# EAGLE design mimic1579 (EAGLE 7.5.0)
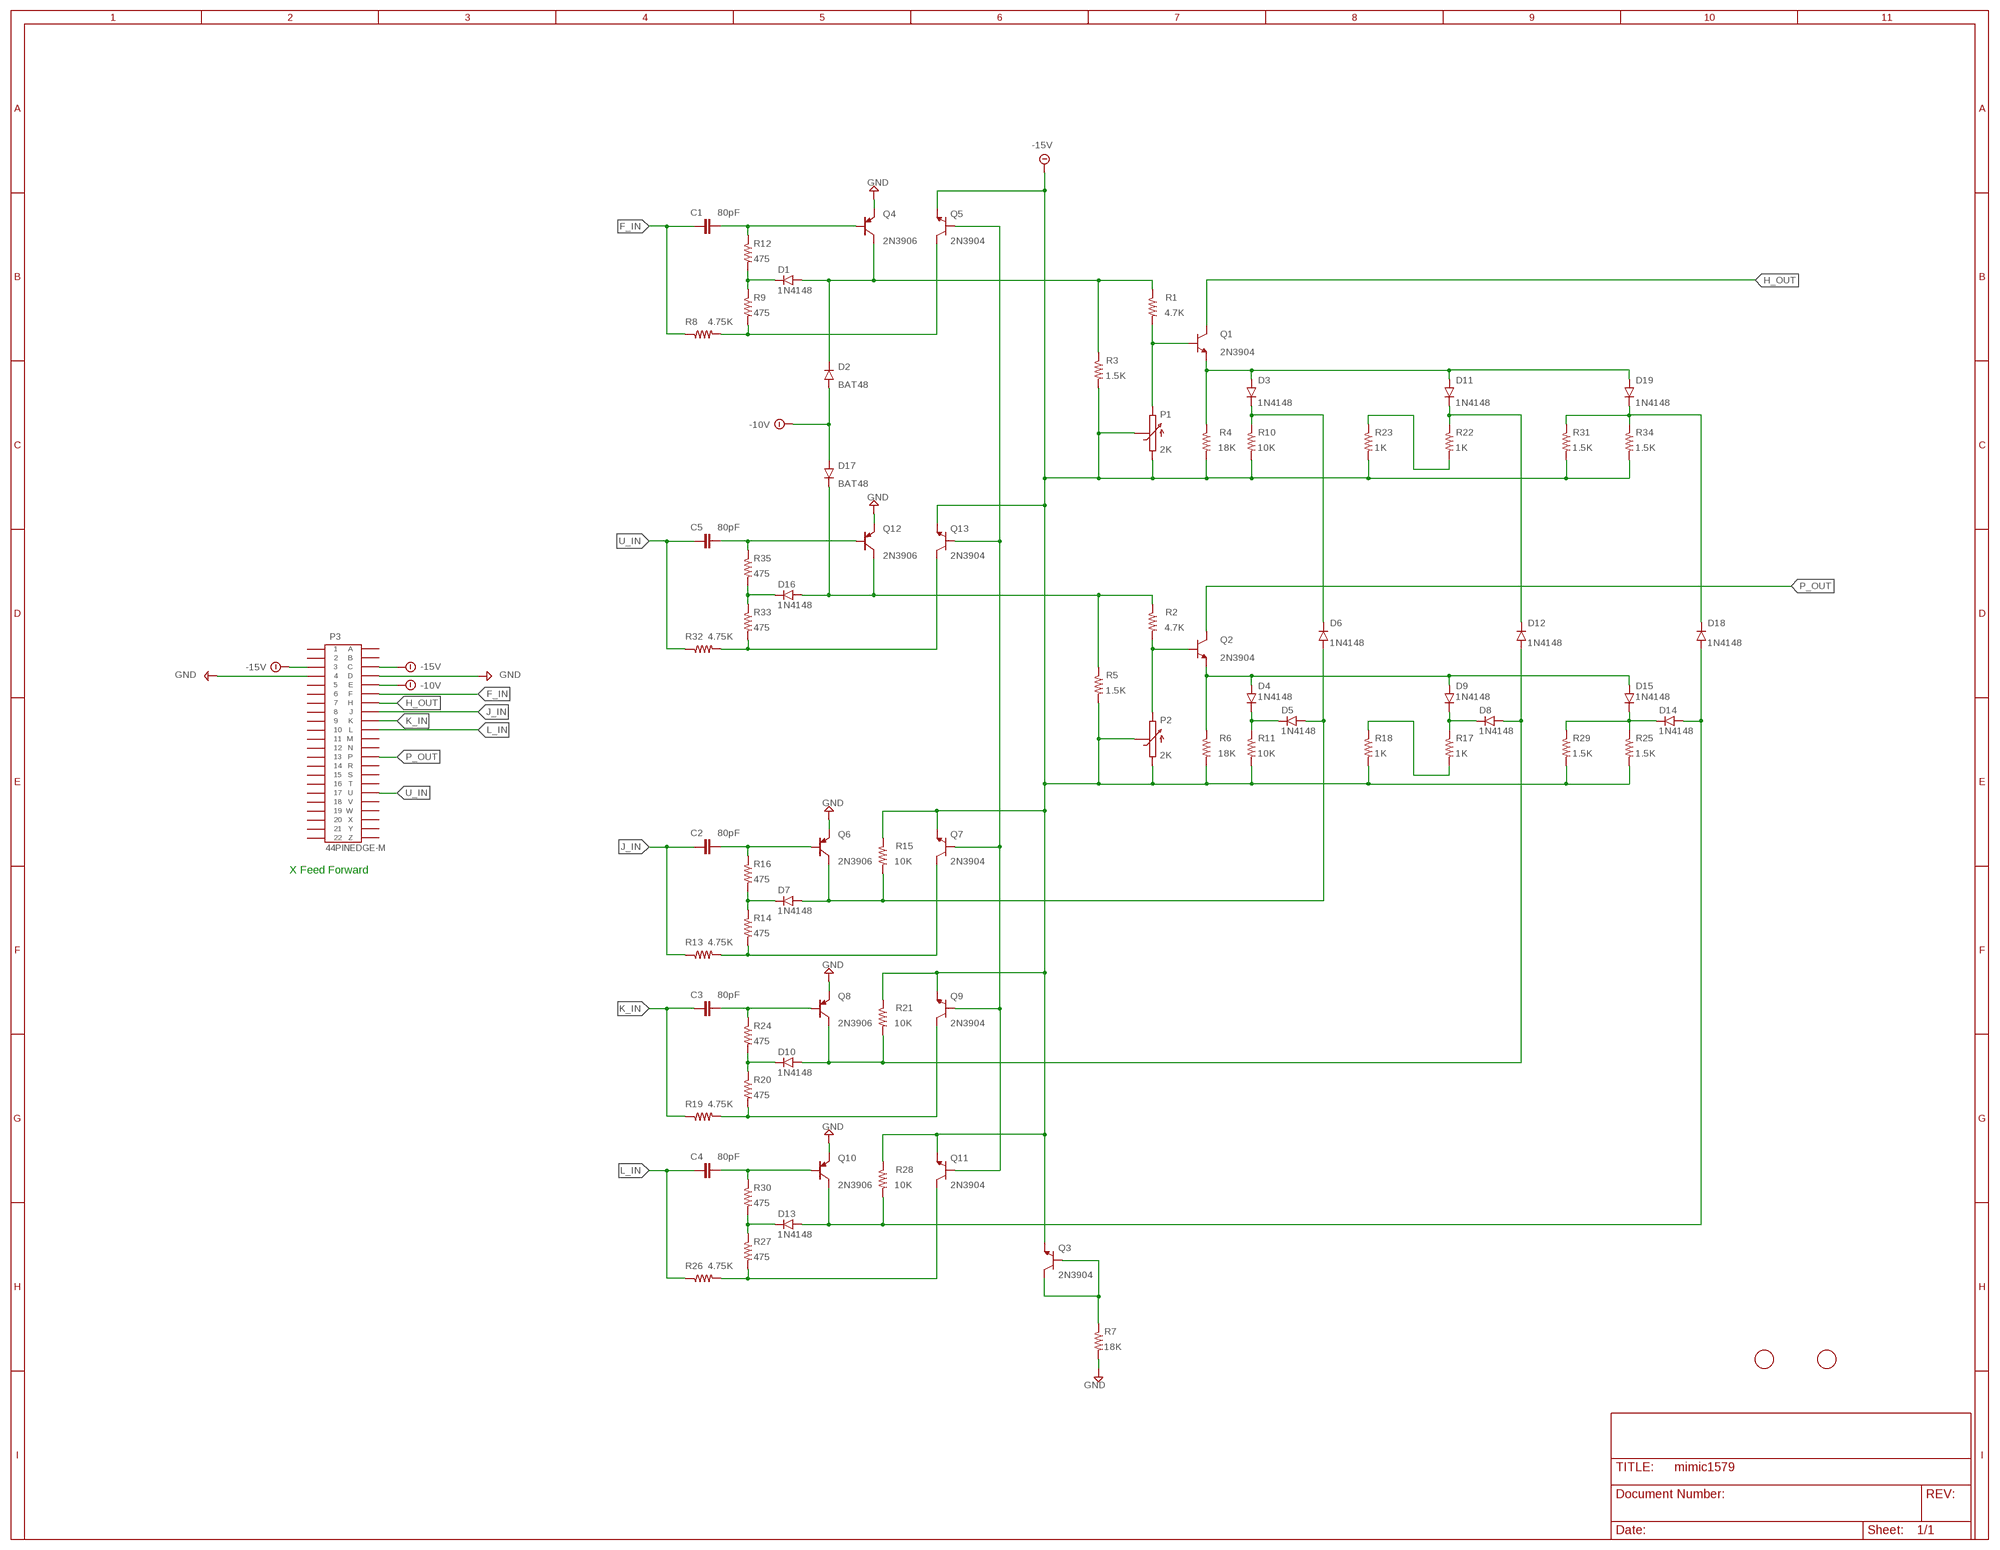
[diagram p0: schematic, sheet 1]

## Parts
C1  80pF  CAP80PF  [5MM_TH]
C2  80pF  CAP80PF  [5MM_TH]
C3  80pF  CAP80PF  [5MM_TH]
C4  80pF  CAP80PF  [5MM_TH]
C5  80pF  CAP80PF  [5MM_TH]
D1  1N4148  [DO35-7]
D2  BAT48  1N4148  [DO35-7]
D3  1N4148  [DO35-7]
D4  1N4148  [DO35-7]
D5  1N4148  [DO35-7]
D6  1N4148  [DO35-7]
D7  1N4148  [DO35-7]
D8  1N4148  [DO35-7]
D9  1N4148  [DO35-7]
D10  1N4148  [DO35-7]
D11  1N4148  [DO35-7]
D12  1N4148  [DO35-7]
D13  1N4148  [DO35-7]
D14  1N4148  [DO35-7]
D15  1N4148  [DO35-7]
D16  1N4148  [DO35-7]
D17  BAT48  1N4148  [DO35-7]
D18  1N4148  [DO35-7]
D19  1N4148  [DO35-7]
P1  2K  POT-3006P  [3006P]
P2  2K  POT-3006P  [3006P]
P3  44PINEDGE-M  [44PINEDGE]
Q1  2N3904  [TO92]
Q2  2N3904  [TO92]
Q3  2N3904  [TO92]
Q4  2N3906  [TO92]
Q5  2N3904  [TO92]
Q6  2N3906  [TO92]
Q7  2N3904  [TO92]
Q8  2N3906  [TO92]
Q9  2N3904  [TO92]
Q10  2N3906  [TO92]
Q11  2N3904  [TO92]
Q12  2N3906  [TO92]
Q13  2N3904  [TO92]
R1  4.7K  R-1/4WATT  [0207/10]
R2  4.7K  R-1/4WATT  [0207/10]
R3  1.5K  R-1/4WATT  [0207/10]
R4  18K  R-1/4WATT  [0207/10]
R5  1.5K  R-1/4WATT  [0207/10]
R6  18K  R-1/4WATT  [0207/10]
R7  18K  R-1/4WATT  [0207/10]
R8  4.75K  R-1/4WATT  [0207/10]
R9  475  R-1/4WATT  [0207/10]
R10  10K  R-1/4WATT  [0207/10]
R11  10K  R-1/4WATT  [0207/10]
R12  475  R-1/4WATT  [0207/10]
R13  4.75K  R-1/4WATT  [0207/10]
R14  475  R-1/4WATT  [0207/10]
R15  10K  R-1/4WATT  [0207/10]
R16  475  R-1/4WATT  [0207/10]
R17  1K  R-1/4WATT  [0207/10]
R18  1K  R-1/4WATT  [0207/10]
R19  4.75K  R-1/4WATT  [0207/10]
R20  475  R-1/4WATT  [0207/10]
R21  10K  R-1/4WATT  [0207/10]
R22  1K  R-1/4WATT  [0207/10]
R23  1K  R-1/4WATT  [0207/10]
R24  475  R-1/4WATT  [0207/10]
R25  1.5K  R-1/4WATT  [0207/10]
R26  4.75K  R-1/4WATT  [0207/10]
R27  475  R-1/4WATT  [0207/10]
R28  10K  R-1/4WATT  [0207/10]
R29  1.5K  R-1/4WATT  [0207/10]
R30  475  R-1/4WATT  [0207/10]
R31  1.5K  R-1/4WATT  [0207/10]
R32  4.75K  R-1/4WATT  [0207/10]
R33  475  R-1/4WATT  [0207/10]
R34  1.5K  R-1/4WATT  [0207/10]
R35  475  R-1/4WATT  [0207/10]
U$1  FIDUCIAL  [FIDUCIAL_1MM]
U$2  FIDUCIAL  [FIDUCIAL_1MM]

## Nets
-10V: D2.A D17.A P3.E
-15V: P1.1 P1.2 P2.1 P2.2 P3.3 P3.C Q3.1(E) Q5.1(E) Q7.1(E) Q9.1(E) Q11.1(E) Q13.1(E) R3.2 R4.2 R5.2 R6.2 R10.2 R11.2 R15.1 R18.2 R21.1 R23.2 R25.2 R28.1 R29.2 R31.2 R34.2
F_IN: C1.1 P3.F R8.1
GND: P3.4 P3.D Q4.3(E) Q6.3(E) Q8.3(E) Q10.3(E) Q12.3(E) R7.2
H_OUT: P3.H Q1.3(C)
J_IN: C2.1 P3.J R13.1
K_IN: C3.1 P3.K R19.1
L_IN: C4.1 P3.L R26.1
N$1: C1.2 Q4.2(B) R12.1
N$2: Q5.3(C) R8.2 R9.2
N$3: C3.2 Q8.2(B) R24.1
N$4: P1.3 Q1.2(B) R1.2
N$5: D3.A D11.A D19.A Q1.1(E) R4.1
N$6: D3.C D6.C R10.1
N$7: R22.2 R23.1
N$8: Q9.3(C) R19.2 R20.2
N$9: D1.C R9.1 R12.2
N$10: D11.C D12.C R22.1
N$11: D18.C D19.C R31.1 R34.1
N$12: D10.C R20.1 R24.2
N$13: C4.2 Q10.2(B) R30.1
N$14: C5.2 Q12.2(B) R35.1
N$15: Q13.3(C) R32.2 R33.2
N$16: P2.3 Q2.2(B) R2.2
N$17: D4.A D9.A D15.A Q2.1(E) R6.1
N$18: D4.C D5.C R11.1
N$19: D8.C D9.C R17.1
N$20: R17.2 R18.1
N$21: D14.C D15.C R25.1 R29.1
N$22: Q11.3(C) R26.2 R27.2
N$23: D13.C R27.1 R30.2
N$24: Q3.2(B) Q3.3(C) R7.1
N$25: D16.C R33.1 R35.2
N$30: C2.2 Q6.2(B) R16.1
N$31: Q7.3(C) R13.2 R14.2
N$32: D7.C R14.1 R16.2
N$33: Q5.2(B) Q7.2(B) Q9.2(B) Q11.2(B) Q13.2(B)
P_OUT: P3.P Q2.3(C)
U_IN: C5.1 P3.U R32.1
VREF: D1.A D2.C Q4.1(C) R1.1 R3.1
VREF1: D8.A D10.A D12.A Q8.1(C) R21.2
VREF2: D13.A D14.A D18.A Q10.1(C) R28.2
VREF3: D5.A D6.A D7.A Q6.1(C) R15.2
VREF5: D16.A D17.C Q12.1(C) R2.1 R5.1
Unconnected: P3.1 P3.2 P3.5 P3.6 P3.7 P3.8 P3.9 P3.10 P3.11 P3.12 P3.13 P3.14 P3.15 P3.16 P3.17 P3.18 P3.19 P3.20 P3.21 P3.22 P3.A P3.B P3.M P3.N P3.R P3.S P3.T P3.V P3.W P3.X P3.Y P3.Z

## Notes on the sheet
- X Feed Forward

## Library data of the parts
C1-C5 = keiths:CAP80PF: 0 Leaded 100V 80pF X7R 10% RAD LS:5mm
D1 D3-D16 D18 D19 = replacements:1N4148: High Conductance Fast Diode
D2 D17 = replacements:1N4148: High Conductance Fast Diode; PN: BAT48RL
P1 P2 = keiths:POT-3006P: 3006 - Trimpot® Trimming Potentiometer. Clockwise turn moves wiper to pin 3
P3 = keiths:44PINEDGE-M: 44 PIN EDGE CONNECTOR FOR PCB
Q1-Q3 Q5 Q7 Q9 Q11 Q13 = keiths:2N3904: NPN Transistor
Q4 Q6 Q8 Q10 Q12 = keiths:2N3906: PNP Transistor
R1-R35 = replacements:R-1/4WATT: Quarter watt through hole resistor.
U$1 U$2 = adafruit:FIDUCIAL: For use by pick and place machines to calibrate the vision/machine, 1mm By microbuilder.eu

## Board
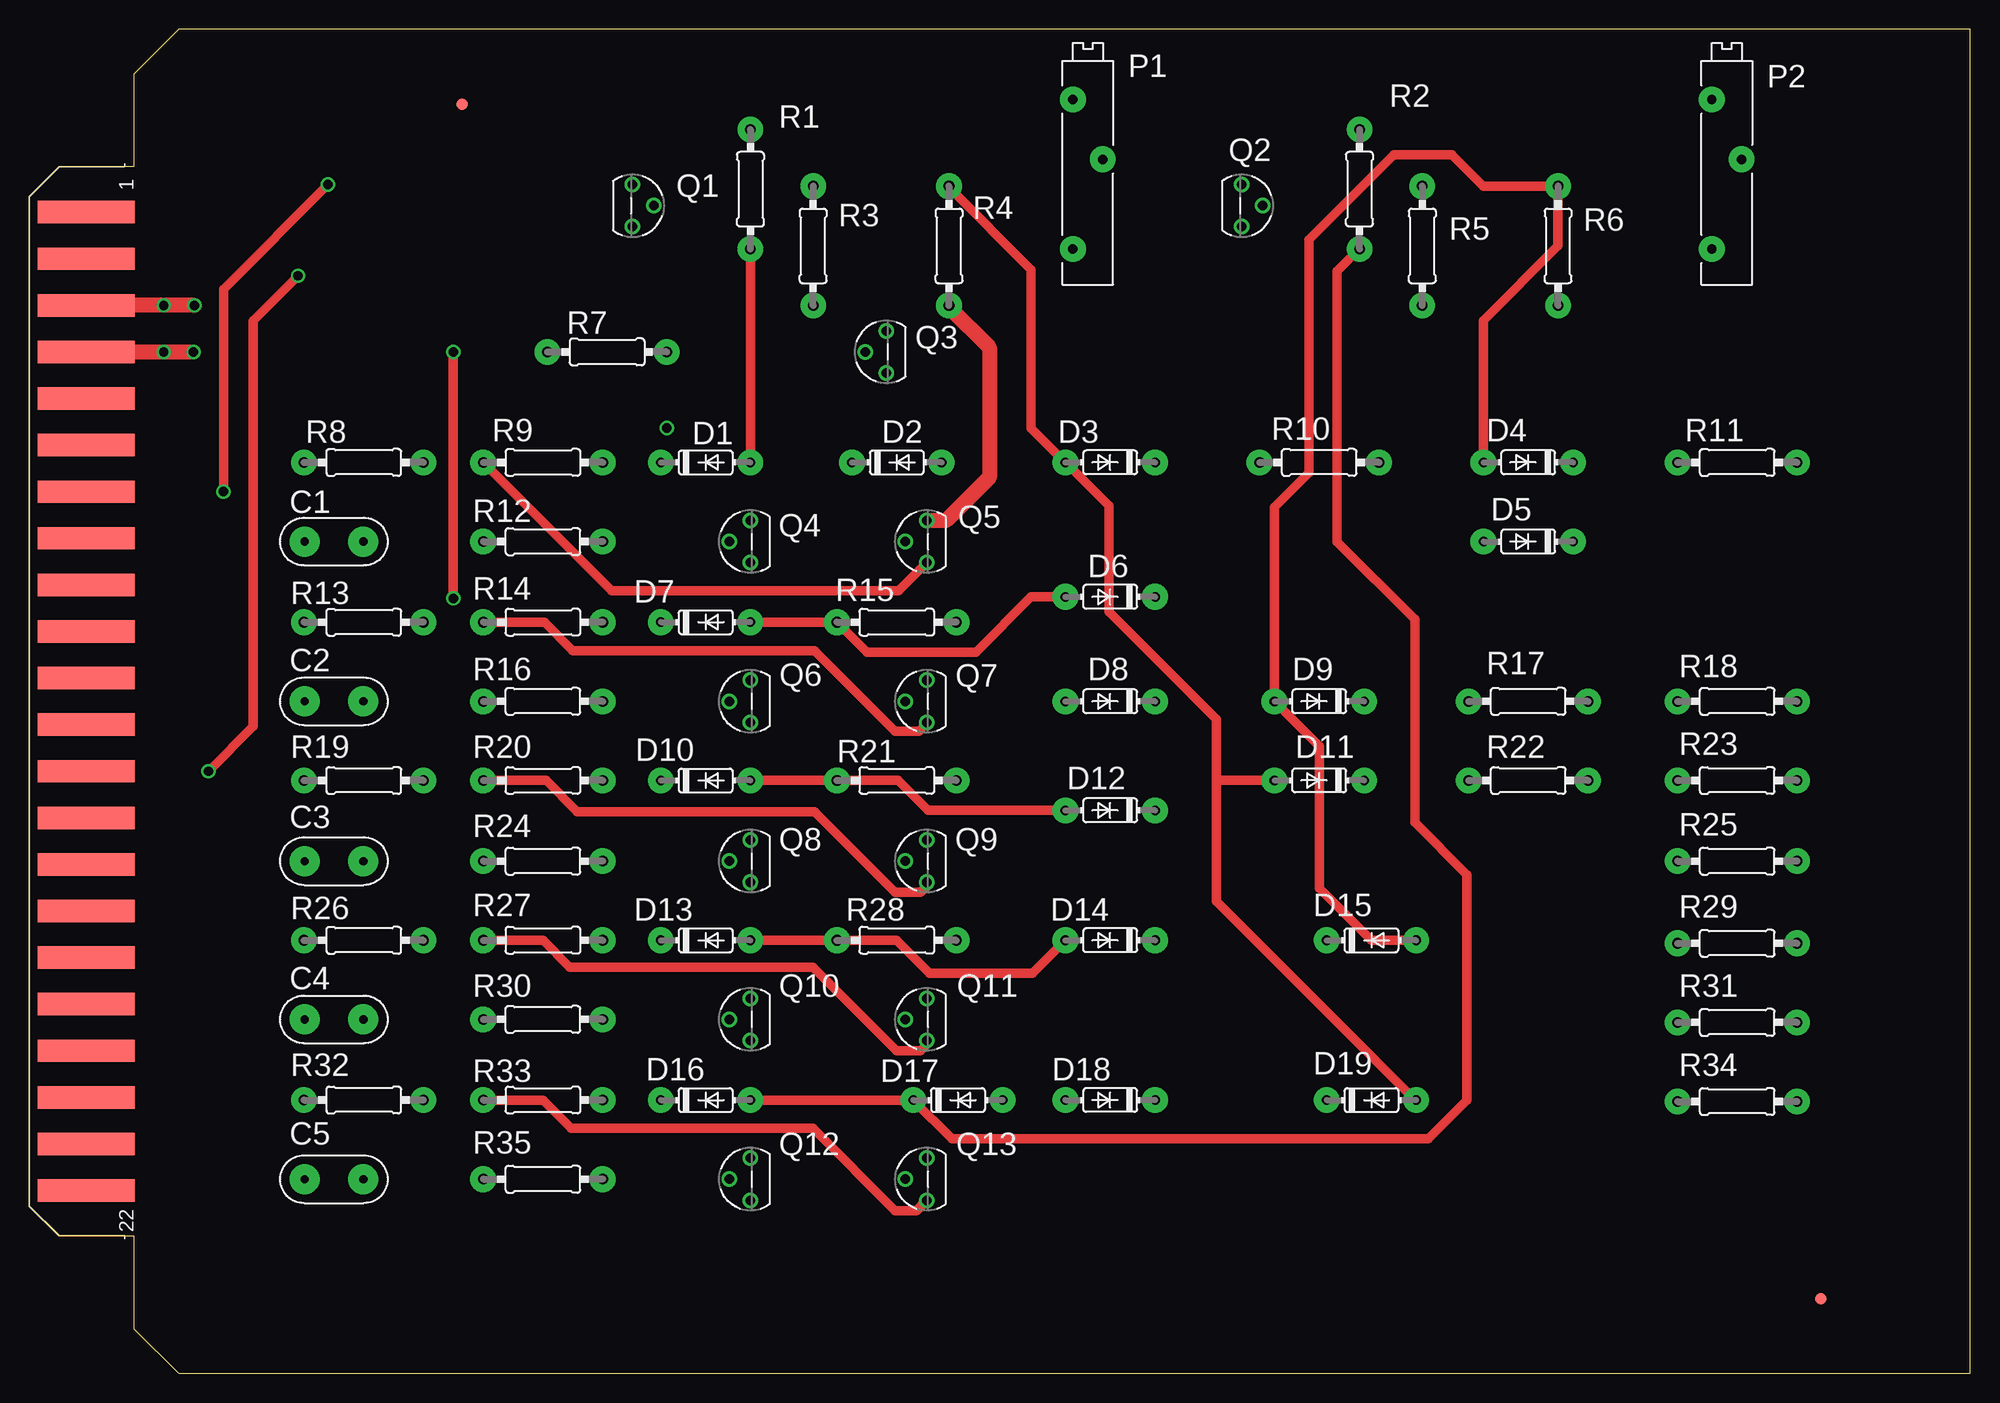
[diagram p1: board, top side]
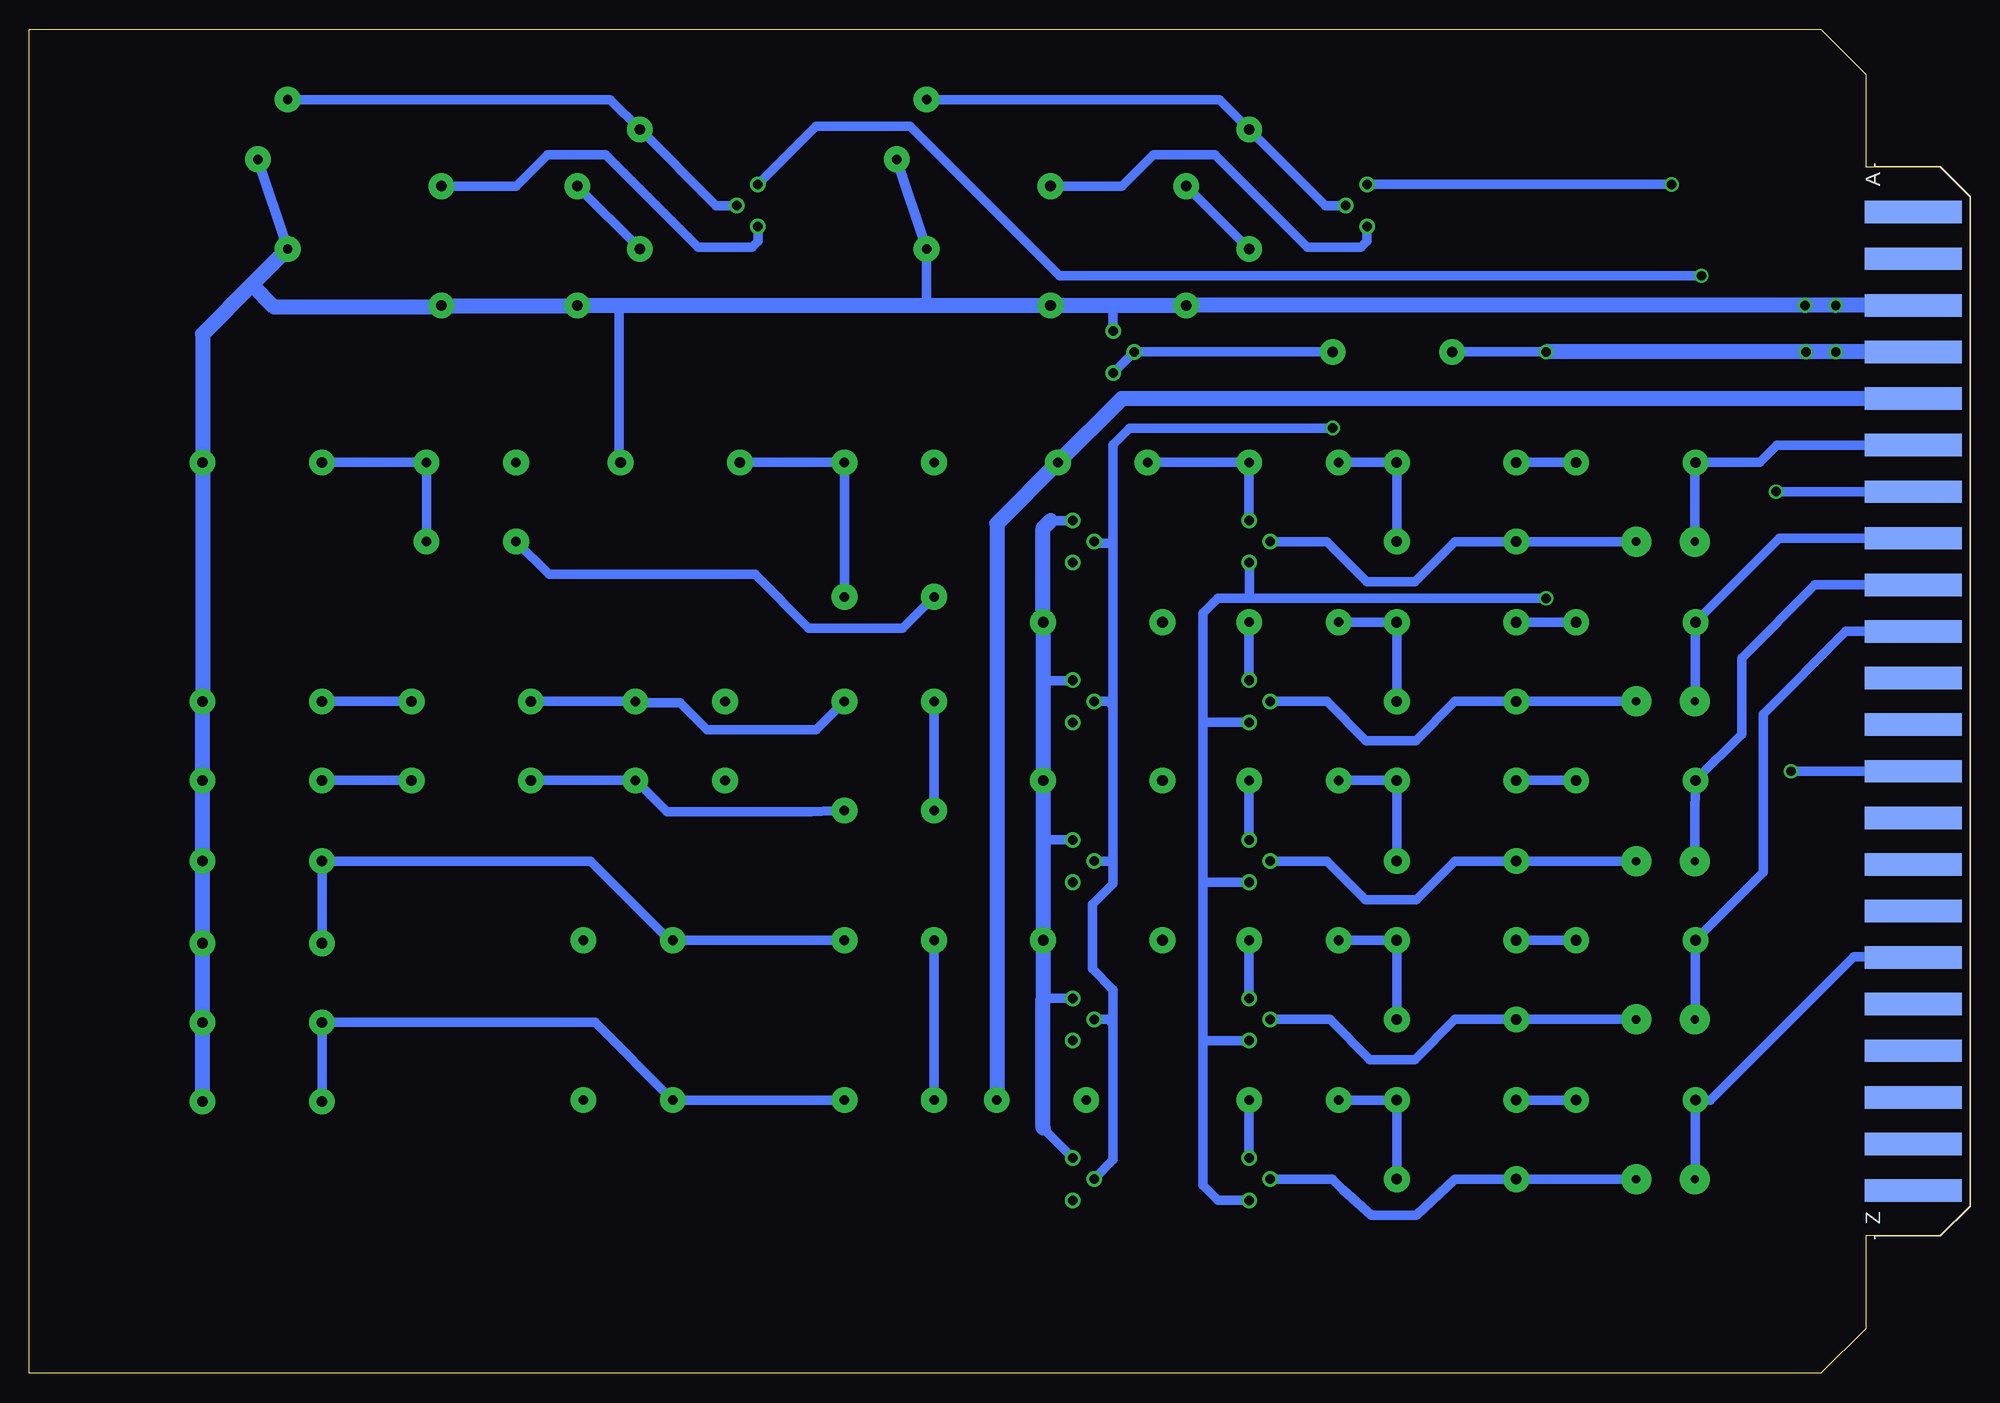
[diagram p2: board, bottom side, seen from below]

Size 165.1 x 114.3 mm. Coordinates in mm from the lower left corner, seen from the top.
Outline: 2.54,11.68 8.89,11.68 8.89,3.81 12.7,0 165.1,0 165.1,114.3 12.7,114.3 8.89,110.49 8.89,102.62 2.54,102.62 0,100.08 0,14.22 2.54,11.68
Copper layers (1*16): Top 0.035mm / dielectric 1.5mm / Bottom 0.035mm
Design rules "default *": minimum track width 10mil, minimum drill 24mil, track to track 8mil, track to pad 8mil, pad to pad 8mil, via to via 8mil, smd to smd 8mil, copper to edge 20mil, drill to drill 8mil, minimum pad ring 10mil, minimum via ring 8mil, stop-mask expansion 4mil, vias tented up to drill 0mil, thermal gap 10mil

### Footprints (pad centres in the part's own frame; a part is rotated, then mirrored left to right if it is on the bottom)
5MM_TH = drill 0.7 pad 2.54: 1 -2.5,0; 2 2.5,0
DO35-7 = drill 0.813 pad 2.184: A 3.81,0; C -3.81,0
3006P = drill 0.8 pad 2.184: 1 -6.477,1.27; 2 1.143,-1.27; 3 6.223,1.27
44PINEDGE = smd 1.905 x 8.255: 1 -41.605,4.826; 2 -37.643,4.826; 3 -33.68,4.826; 4 -29.718,4.826; 5 -25.756,4.826; 6 -21.793,4.826; 7 -17.831,4.826; 8 -13.868,4.826; 9 -9.906,4.826; 10 -5.944,4.826; 11 -1.981,4.826; 12 1.981,4.826; 13 5.944,4.826; 14 9.906,4.826; 15 13.868,4.826; 16 17.831,4.826; 17 21.793,4.826; 18 25.756,4.826; 19 29.718,4.826; 20 33.68,4.826; 21 37.643,4.826; 22 41.605,4.826 | smd 1.905 x 8.255 bottom: A -41.605,4.826; B -37.643,4.826; C -33.68,4.826; D -29.718,4.826; E -25.756,4.826; F -21.793,4.826; H -17.831,4.826; J -13.868,4.826; K -9.906,4.826; L -5.944,4.826; M -1.981,4.826; N 1.981,4.826; P 5.944,4.826; R 9.906,4.826; S 13.868,4.826; T 17.831,4.826; U 21.793,4.826; V 25.756,4.826; W 29.718,4.826; X 33.68,4.826; Y 37.643,4.826; Z 41.605,4.826
TO92 = drill 0.813: 1 1.27,-1.27; 2 1.27,1.27; 3 -1.27,1.27
0207/10 = drill 0.9 pad 2.184: 1 -5.08,0; 2 5.08,0
FIDUCIAL_1MM = smd 1 x 1: 1 0,0

### Placement (x,y rotation side)
C1  25.91,70.74 0 top
C2  25.91,57.15 0 top
C3  25.91,43.56 0 top
C4  25.91,30.1 0 top
C5  25.91,16.51 0 top
D1  57.53,77.47 0 top
D2  73.79,77.47 0 top
D3  91.95,77.47 180 top
D4  127.51,77.47 180 top
D5  127.51,70.74 180 top
D6  91.95,66.04 180 top
D7  57.53,63.88 0 top
D8  91.95,57.15 180 top
D9  109.73,57.15 180 top
D10  57.53,50.42 0 top
D11  109.73,50.42 180 top
D12  91.95,47.88 180 top
D13  57.53,36.83 0 top
D14  91.95,36.83 180 top
D15  114.17,36.83 0 top
D16  57.53,23.24 0 top
D17  78.99,23.24 0 top
D18  91.95,23.24 180 top
D19  114.17,23.24 0 top
P1  90.04,102.11 90 top
P2  144.4,102.11 90 top
P3  0,57.15 270 top
Q1  51.31,99.31 315 top
Q2  103.12,99.31 315 top
Q3  72.9,86.87 135 top
Q4  61.34,70.74 135 top
Q5  76.33,70.74 135 top
Q6  61.34,57.15 135 top
Q7  76.33,57.15 135 top
Q8  61.34,43.56 135 top
Q9  76.33,43.56 135 top
Q10  61.34,30.1 135 top
Q11  76.33,30.1 135 top
Q12  61.34,16.51 135 top
Q13  76.33,16.51 135 top
R1  61.34,100.71 90 top
R2  113.16,100.71 90 top
R3  66.67,95.89 270 top
R4  78.23,95.89 270 top
R5  118.49,95.89 270 top
R6  130.05,95.89 270 top
R7  49.15,86.87 180 top
R8  28.45,77.47 0 top
R9  43.69,77.47 180 top
R10  109.73,77.47 0 top
R11  145.29,77.47 0 top
R12  43.69,70.74 0 top
R13  28.45,63.88 0 top
R14  43.69,63.88 180 top
R15  73.79,63.88 180 top
R16  43.69,57.15 0 top
R17  127.51,57.15 0 top
R18  145.29,57.15 0 top
R19  28.45,50.42 0 top
R20  43.69,50.42 180 top
R21  73.79,50.42 180 top
R22  127.51,50.42 0 top
R23  145.29,50.42 0 top
R24  43.69,43.56 0 top
R25  145.29,43.56 0 top
R26  28.45,36.83 0 top
R27  43.69,36.83 180 top
R28  73.79,36.83 180 top
R29  145.29,36.58 0 top
R30  43.69,30.1 0 top
R31  145.29,29.84 0 top
R32  28.45,23.24 0 top
R33  43.69,23.24 180 top
R34  145.29,23.11 0 top
R35  43.69,16.51 0 top
U$1  36.83,107.95 0 top
U$2  152.4,6.35 0 top

### Tracks (layer width: path | path; a pad name or v marks a point on that pad's centre or on a via)
-10V
  Bottom 1.27: D17.A 82.8,72.26 D2.A 72.16,82.91 P3.E
-15V  (via drill 0.8)
  Top 0.254: 5.03,90.83 P3.3
  Top 0.813: R4.2 78.23,90.68 | 76.34,72.52 Q5.1
  Top 1.27: 78.23,90.68 81.66,87.25 81.66,76.2 77.98,72.52 76.34,72.52 | v14.05,90.83 5.03,90.83
  Bottom 0.254: v14.05,90.83 5.03,91.44 P3.3
  Bottom 0.813: Q3.1 72.9,90.81 | P1.2 P1.1 88.77,90.81 | P2.1 P2.2 | Q7.1 76.33,58.9 78.87,58.9 | Q9.1 78.87,45.36 | Q11.1 78.87,31.9 | Q13.1 78.87,20.85 | 78.23,72.52 76.34,72.52 Q5.1 | R6.2 130.18,90.68 | 146.11,92.52 146.11,92.65 | R10.2 114.94,77.6 114.94,90.81
  Bottom 1.27: R6.2 R5.2 114.94,90.81 88.77,90.81 R4.2 72.9,90.81 R3.2 66.65,90.83 v14.05,90.83 v11.43,90.83 P3.3 | 78.87,20.85 78.87,31.9 R28.1 78.87,45.36 R21.1 78.87,58.9 R15.1 78.87,71.88 78.23,72.52 | R34.2 R31.2 R29.2 R25.2 R23.2 R18.2 R11.2 150.37,88.39 146.11,92.65 P2.1 | 130.18,90.68 144.27,90.68 146.11,92.52
F_IN
  Bottom 0.813: C1.1 23.41,76.8 R8.1 17.91,77.47 16.43,78.94 P3.F
GND  (via drill 0.8)
  Top 0.813: v36.07,65.91 v36.07,86.87
  Top 1.27: P3.D v11.43,86.87 v13.97,86.87
  Bottom 0.813: v36.07,86.87 R7.2 | Q10.3 65.28,28.3 | 61.32,65.91 64.01,65.91 65.28,64.64 65.28,55.5 | 61.32,65.91 v36.07,65.91 | Q12.3 61.36,14.73 64.01,14.73 65.28,16 65.28,28.3 | 65.28,41.78 65.28,28.3 | Q6.3 65.13,55.35 65.28,55.5 | Q8.3 65.26,41.77 65.28,41.78 | 65.28,55.5 65.28,41.78 | Q4.3 61.32,68.92 61.32,65.91
  Bottom 1.27: P3.D v11.43,86.87 v13.97,86.87 v36.07,86.87
H_OUT  (via drill 0.8)
  Top 0.813: v16.51,74.98 16.51,92.22 v25.4,101.11
  Bottom 0.813: v25.4,101.11 Q1.3 | P3.H v16.51,74.98
J_IN
  Bottom 0.813: C2.1 23.37,57.19 R13.1 16.23,71.02 P3.J
K_IN
  Bottom 0.813: C3.1 23.41,46.95 R19.1 19.43,54.36 19.43,60.83 13.21,67.06 P3.K
L_IN
  Bottom 0.813: C4.1 23.37,30.14 R26.1 17.59,42.61 17.59,56.07 10.57,63.09 P3.L
N$1
  Bottom 0.813: C1.2 R12.1 43.81,70.74 47.24,67.31 51.31,67.31 54.74,70.74 Q4.2
N$2
  Top 0.813: Q5.3 73.93,66.55 49.53,66.55 R9.2
  Bottom 0.813: R8.2 R9.2
N$3
  Bottom 0.813: C3.2 R24.1 43.81,43.56 47.12,40.26 51.44,40.26 54.74,43.56 Q8.2
N$4
  Bottom 0.813: P1.3 63.88,108.33 R1.2 54.86,99.31 Q1.2
N$5
  Top 0.254: 88.09,77.5 D3.A | 78.26,100.81 R4.1 | 117.81,23.32 D19.A
  Top 0.813: 117.81,23.32 100.97,40.16 100.97,50.42 | 100.97,50.42 100.97,55.63 91.82,64.77 91.82,73.79 D3.A 88.11,77.47 85.22,80.37 85.22,93.85 78.26,100.81 | D11.A 100.97,50.42
  Bottom 0.813: R4.1 72.14,100.97 69.47,103.63 64.26,103.63 56.39,95.76 51.82,95.76 51.31,96.27 Q1.1
N$6
  Bottom 0.813: R10.1 D3.C D6.C
N$7
  Bottom 0.813: R23.1 R22.2
N$8
  Top 0.813: Q9.3 76.33,41.4 75.82,40.89 73.66,40.89 66.8,47.75 46.61,47.75 43.94,50.42 R20.2 38.1,50.42
  Bottom 0.813: R19.2 R20.2
N$9
  Bottom 0.813: D1.C R9.1 R12.2
N$10
  Bottom 0.813: R22.1 D11.C 110.87,47.75 98.55,47.75 D12.C
N$11
  Bottom 0.813: D18.C D19.C 116.97,29.84 R31.1 R34.1
N$12
  Bottom 0.813: D10.C R20.1 R24.2
N$13
  Bottom 0.813: C4.2 R30.1 43.81,30.1 47.24,26.67 51.05,26.67 54.48,30.1 Q10.2
N$14
  Bottom 0.813: C5.2 R35.1 43.81,16.51 47.12,13.46 50.93,13.46 53.34,15.62 54.23,16.51 Q12.2
N$15
  Top 0.813: Q13.3 75.46,13.84 73.66,13.84 66.67,20.83 46.1,20.83 43.69,23.24 R33.2
  Bottom 0.813: R32.2 R33.2
N$16
  Bottom 0.813: P2.3 115.7,108.33 R2.2 106.68,99.31 Q2.2
N$17
  Top 0.254: 129.92,100.81 R6.1
  Top 0.813: D4.A 123.7,89.53 130.05,95.89 R6.1 123.7,100.97 121.03,103.63 116.08,103.63 108.84,96.39 108.84,76.58 105.92,73.66 D9.A 109.73,53.34 109.73,41.27 114.17,36.83 D15.A
  Bottom 0.813: R6.1 123.7,100.97 121.03,103.63 116.08,103.63 108.2,95.76 103.63,95.76 103.12,96.27 Q2.1
N$18
  Bottom 0.813: D5.C D4.C R11.1
N$19
  Bottom 0.813: R17.1 D9.C 113.41,57.02 109.73,57.02 107.44,54.74 98.17,54.74 D8.C
N$20
  Bottom 0.813: R18.1 R17.2
N$21
  Bottom 0.813: D14.C D15.C 110.49,36.7 117.35,43.56 R25.1 R29.1
N$22
  Top 0.813: Q11.3 76.33,27.94 75.82,27.43 73.79,27.43 66.67,34.54 45.97,34.54 43.69,36.83 R27.2
  Bottom 0.813: R26.2 R27.2
N$23
  Bottom 0.813: R30.2 R27.1 D13.C
N$24
  Bottom 0.813: R7.1 Q3.2 Q3.3
N$25
  Bottom 0.813: R35.2 R33.1 D16.C
N$30
  Bottom 0.813: Q6.2 54.74,57.15 51.38,53.8 47.17,53.8 43.81,57.15 R16.1 C2.2
N$31
  Top 0.813: R14.2 43.81,63.88 46.23,61.47 66.8,61.47 73.66,54.61 75.69,54.61 76.33,55.24 Q7.3
  Bottom 0.813: R14.2 R13.2
N$32
  Bottom 0.813: R16.2 R14.1 D7.C
N$33  (via drill 0.8)
  Bottom 0.254: Q5.2 74.52,70.87 74.42,70.61
  Bottom 0.813: Q7.2 73.28,57.15 72.9,56.77 | Q9.2 73.15,43.56 72.9,43.81 | Q11.2 73.28,30.1 72.9,29.72 | v54.23,80.39 71.5,80.39 72.9,78.99 72.9,70.61 | Q13.2 72.9,18.14 72.9,29.72 | 72.9,29.72 72.9,32.64 74.68,34.42 74.68,39.88 72.9,41.66 72.9,43.81 | 72.9,70.61 72.9,56.77 | 74.53,70.72 74.42,70.61 72.9,70.61 | 72.9,43.81 72.9,56.77
P_OUT  (via drill 0.8)
  Top 0.813: v15.24,51.21 19.05,55.02 19.05,89.53 v22.86,93.34
  Bottom 0.813: v22.86,93.34 77.47,93.34 90.17,106.05 98.19,106.05 Q2.3 | P3.P v15.24,51.21
U_IN
  Bottom 0.813: C5.1 23.37,16.55 R32.1 22.1,23.24 9.91,35.43 5.97,35.43 | 4.9,35.43 5.97,35.43 | P3.U 5.89,35.36 5.97,35.43
VREF
  Top 0.813: D1.A R1.1
  Bottom 0.813: D2.C D1.A Q4.1 | R1.1 R3.1
VREF1
  Top 0.813: D10.A R21.2 73.91,50.42 76.45,47.88 D12.A
  Bottom 0.813: Q8.1 D10.A | D8.A D12.A
VREF2
  Top 0.813: D13.A R28.2 73.79,36.83 76.58,34.04 85.34,34.04 D14.A
  Bottom 0.813: Q10.1 D13.A | D18.A D14.A
VREF3
  Top 0.813: D7.A R15.2 71.25,61.34 80.52,61.34 85.22,66.04 D6.A
  Bottom 0.813: Q6.1 D7.A | D5.A 120.9,67.94 103.38,67.94 98.81,63.37 90.81,63.37 D6.A
VREF5
  Top 0.813: D16.A D17.C 78.49,19.94 119,19.94 122.3,23.24 122.3,42.42 117.86,46.86 117.86,64.14 111.25,70.74 111.25,93.73 R2.1
  Bottom 0.813: Q12.1 D16.A | R2.1 R5.1

### Text on the board
logo: board type 1579 / feed forward